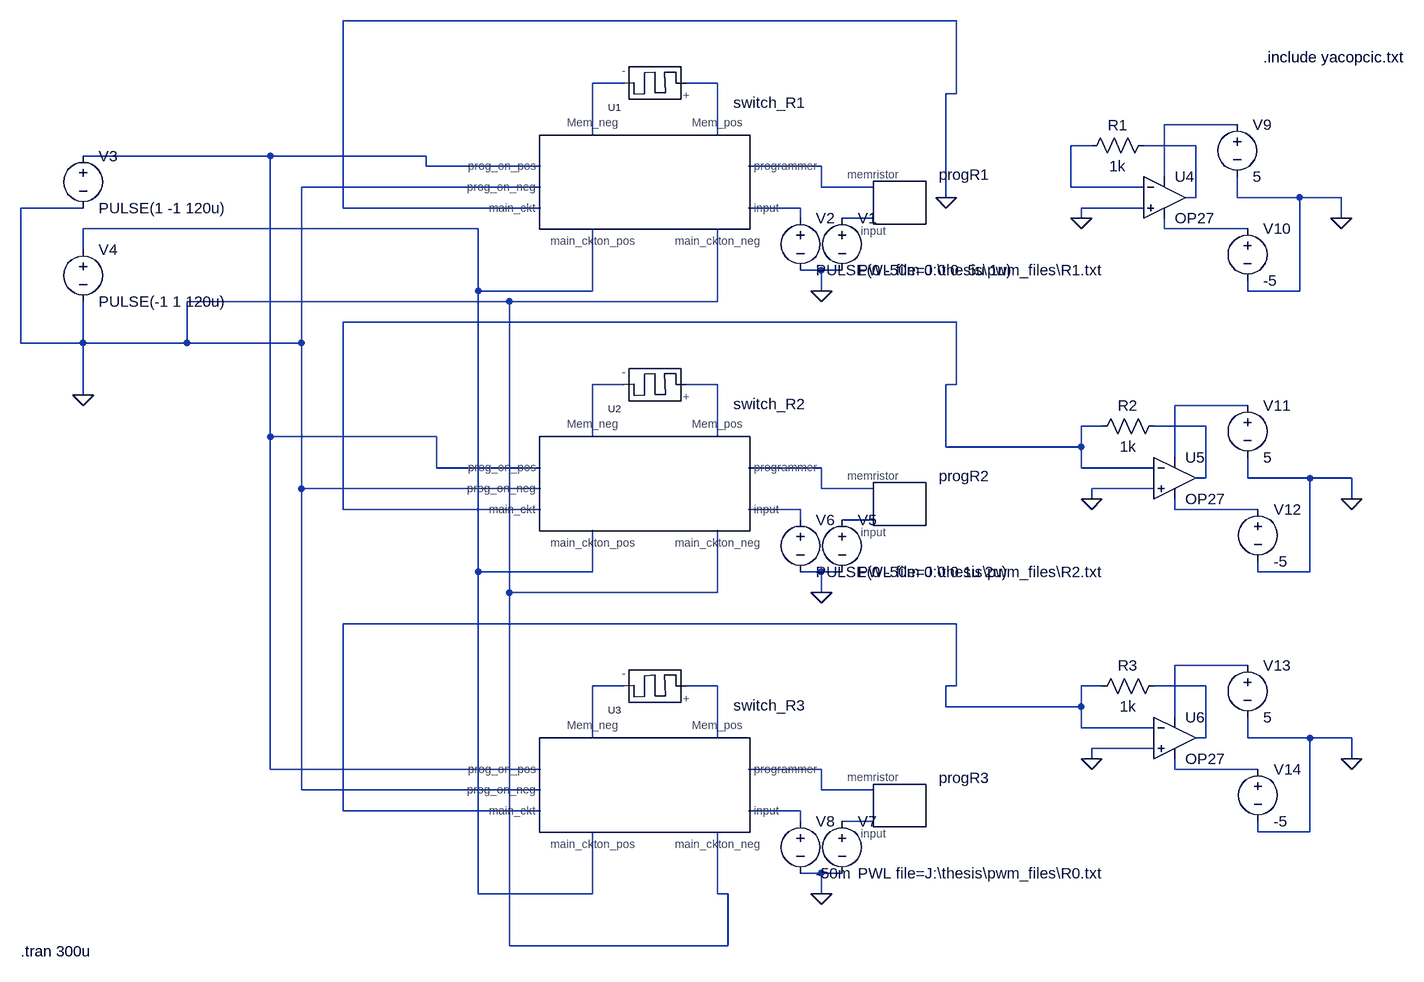
[diagram p0: schematic problem.asc]
problem.asc, the LTspice schematic file:
Version 4
SHEET 1 880 680
WIRE -16 -784 -960 -784
WIRE -528 -688 -576 -688
WIRE -384 -688 -432 -688
WIRE -16 -672 -16 -784
WIRE -16 -672 -32 -672
WIRE 416 -624 304 -624
WIRE -576 -608 -576 -688
WIRE -384 -608 -384 -688
WIRE 192 -592 160 -592
WIRE 352 -592 272 -592
WIRE -1072 -576 -1360 -576
WIRE -832 -576 -1072 -576
WIRE -832 -560 -832 -576
WIRE -656 -560 -832 -560
WIRE -224 -560 -336 -560
WIRE 304 -544 304 -624
WIRE -656 -528 -1024 -528
WIRE -224 -528 -224 -560
WIRE -144 -528 -224 -528
WIRE 160 -528 160 -592
WIRE 272 -528 160 -528
WIRE -32 -512 -32 -672
WIRE 352 -512 352 -592
WIRE 352 -512 336 -512
WIRE 416 -512 416 -544
WIRE 512 -512 416 -512
WIRE 576 -512 512 -512
WIRE -1360 -496 -1456 -496
WIRE -960 -496 -960 -784
WIRE -656 -496 -960 -496
WIRE -256 -496 -336 -496
WIRE 272 -496 176 -496
WIRE -256 -480 -256 -496
WIRE -144 -480 -192 -480
WIRE 176 -480 176 -496
WIRE 576 -480 576 -512
WIRE -752 -464 -1360 -464
WIRE 304 -464 304 -480
WIRE 432 -464 304 -464
WIRE -1360 -432 -1360 -464
WIRE -224 -400 -256 -400
WIRE -192 -400 -224 -400
WIRE -752 -368 -752 -464
WIRE -576 -368 -576 -464
WIRE -576 -368 -752 -368
WIRE -224 -368 -224 -400
WIRE 432 -368 432 -384
WIRE 512 -368 512 -512
WIRE 512 -368 432 -368
WIRE -704 -352 -1200 -352
WIRE -384 -352 -384 -464
WIRE -384 -352 -704 -352
WIRE -16 -320 -960 -320
WIRE -1456 -288 -1456 -496
WIRE -1360 -288 -1360 -352
WIRE -1360 -288 -1456 -288
WIRE -1200 -288 -1200 -352
WIRE -1200 -288 -1360 -288
WIRE -1024 -288 -1024 -528
WIRE -1024 -288 -1200 -288
WIRE -528 -224 -576 -224
WIRE -384 -224 -432 -224
WIRE -16 -224 -16 -320
WIRE -16 -224 -32 -224
WIRE -1360 -208 -1360 -288
WIRE 432 -192 320 -192
WIRE 208 -160 176 -160
WIRE 368 -160 288 -160
WIRE -1072 -144 -1072 -576
WIRE -816 -144 -1072 -144
WIRE -576 -144 -576 -224
WIRE -384 -144 -384 -224
WIRE -32 -128 -32 -224
WIRE 176 -128 176 -160
WIRE 176 -128 -32 -128
WIRE 320 -112 320 -192
WIRE -816 -96 -816 -144
WIRE -656 -96 -816 -96
WIRE -224 -96 -336 -96
WIRE 176 -96 176 -128
WIRE 288 -96 176 -96
WIRE 368 -80 368 -160
WIRE 368 -80 352 -80
WIRE 432 -80 432 -112
WIRE 528 -80 432 -80
WIRE 592 -80 528 -80
WIRE -1024 -64 -1024 -288
WIRE -656 -64 -1024 -64
WIRE -224 -64 -224 -96
WIRE -144 -64 -224 -64
WIRE 288 -64 192 -64
WIRE 192 -48 192 -64
WIRE 592 -48 592 -80
WIRE -960 -32 -960 -320
WIRE -656 -32 -960 -32
WIRE -256 -32 -336 -32
WIRE 320 -32 320 -48
WIRE 448 -32 320 -32
WIRE -256 -16 -256 -32
WIRE -144 -16 -192 -16
WIRE -752 64 -752 -368
WIRE -576 64 -576 0
WIRE -576 64 -752 64
WIRE -224 64 -256 64
WIRE -192 64 -224 64
WIRE 448 64 448 48
WIRE 528 64 528 -80
WIRE 528 64 448 64
WIRE -704 96 -704 -352
WIRE -384 96 -384 0
WIRE -384 96 -704 96
WIRE -224 96 -224 64
WIRE -16 144 -960 144
WIRE 432 208 320 208
WIRE -528 240 -576 240
WIRE -384 240 -432 240
WIRE -16 240 -16 144
WIRE -16 240 -32 240
WIRE 208 240 176 240
WIRE 368 240 288 240
WIRE -32 272 -32 240
WIRE 176 272 176 240
WIRE 176 272 -32 272
WIRE 320 288 320 208
WIRE 176 304 176 272
WIRE 288 304 176 304
WIRE -576 320 -576 240
WIRE -384 320 -384 240
WIRE 368 320 368 240
WIRE 368 320 352 320
WIRE 432 320 432 288
WIRE 528 320 432 320
WIRE 592 320 528 320
WIRE 288 336 192 336
WIRE 192 352 192 336
WIRE 592 352 592 320
WIRE -1072 368 -1072 -144
WIRE -656 368 -1072 368
WIRE -224 368 -336 368
WIRE 320 368 320 352
WIRE 448 368 320 368
WIRE -1024 400 -1024 -64
WIRE -656 400 -1024 400
WIRE -224 400 -224 368
WIRE -144 400 -224 400
WIRE -960 432 -960 144
WIRE -656 432 -960 432
WIRE -256 432 -336 432
WIRE -256 448 -256 432
WIRE -144 448 -192 448
WIRE 448 464 448 448
WIRE 528 464 528 320
WIRE 528 464 448 464
WIRE -224 528 -256 528
WIRE -192 528 -224 528
WIRE -752 560 -752 64
WIRE -576 560 -576 464
WIRE -576 560 -752 560
WIRE -384 560 -384 464
WIRE -368 560 -384 560
WIRE -224 560 -224 528
WIRE -704 640 -704 96
WIRE -368 640 -368 560
WIRE -368 640 -704 640
FLAG -224 -368 0
FLAG -224 96 0
FLAG -224 560 0
FLAG -1360 -208 0
FLAG 176 -480 0
FLAG 576 -480 0
FLAG 192 -48 0
FLAG 592 -48 0
FLAG 192 352 0
FLAG 592 352 0
FLAG -32 -512 0
SYMBOL memristormodel -512 -688 R180
SYMATTR InstName U1
SYMATTR Value MEM_YAKOPCIC
SYMBOL switch_block -576 -560 R0
SYMATTR InstName switch_R1
SYMBOL programmer_block -96 -480 R0
SYMATTR InstName progR1
SYMBOL voltage -192 -496 R0
WINDOW 123 0 0 Left 2
WINDOW 39 0 0 Left 2
SYMATTR InstName V1
SYMATTR Value PWL file=J:\thesis\pwm_files\R1.txt
SYMBOL voltage -256 -496 R0
WINDOW 123 0 0 Left 2
WINDOW 39 0 0 Left 2
SYMATTR InstName V2
SYMATTR Value PULSE(0 -50m 0 0 0 .5u 1u)
SYMBOL voltage -1360 -592 R0
WINDOW 123 0 0 Left 2
WINDOW 39 0 0 Left 2
SYMATTR InstName V3
SYMATTR Value PULSE(1 -1 120u)
SYMBOL voltage -1360 -448 R0
WINDOW 123 0 0 Left 2
WINDOW 39 0 0 Left 2
SYMATTR InstName V4
SYMATTR Value PULSE(-1 1 120u)
SYMBOL memristormodel -512 -224 R180
SYMATTR InstName U2
SYMATTR Value MEM_YAKOPCIC
SYMBOL switch_block -576 -96 R0
SYMATTR InstName switch_R2
SYMBOL programmer_block -96 -16 R0
SYMATTR InstName progR2
SYMBOL voltage -192 -32 R0
WINDOW 123 0 0 Left 2
WINDOW 39 0 0 Left 2
SYMATTR InstName V5
SYMATTR Value PWL file=J:\thesis\pwm_files\R2.txt
SYMBOL voltage -256 -32 R0
WINDOW 123 0 0 Left 2
WINDOW 39 0 0 Left 2
SYMATTR InstName V6
SYMATTR Value PULSE(0 -50m 0 0 0 1u 2u)
SYMBOL memristormodel -512 240 R180
SYMATTR InstName U3
SYMATTR Value MEM_YAKOPCIC
SYMBOL switch_block -576 368 R0
SYMATTR InstName switch_R3
SYMBOL programmer_block -96 448 R0
SYMATTR InstName progR3
SYMBOL voltage -192 432 R0
WINDOW 123 0 0 Left 2
WINDOW 39 0 0 Left 2
SYMATTR InstName V7
SYMATTR Value PWL file=J:\thesis\pwm_files\R0.txt
SYMBOL voltage -256 432 R0
WINDOW 123 0 0 Left 2
WINDOW 39 0 0 Left 2
SYMATTR InstName V8
SYMATTR Value -50m
SYMBOL voltage 416 -640 R0
WINDOW 123 0 0 Left 2
WINDOW 39 0 0 Left 2
SYMATTR InstName V9
SYMATTR Value 5
SYMBOL voltage 432 -480 R0
WINDOW 123 0 0 Left 2
WINDOW 39 0 0 Left 2
SYMATTR InstName V10
SYMATTR Value -5
SYMBOL res 288 -608 R90
WINDOW 0 0 56 VBottom 2
WINDOW 3 32 56 VTop 2
SYMATTR InstName R1
SYMATTR Value 1k
SYMBOL voltage 432 -208 R0
WINDOW 123 0 0 Left 2
WINDOW 39 0 0 Left 2
SYMATTR InstName V11
SYMATTR Value 5
SYMBOL voltage 448 -48 R0
WINDOW 123 0 0 Left 2
WINDOW 39 0 0 Left 2
SYMATTR InstName V12
SYMATTR Value -5
SYMBOL res 304 -176 R90
WINDOW 0 0 56 VBottom 2
WINDOW 3 32 56 VTop 2
SYMATTR InstName R2
SYMATTR Value 1k
SYMBOL voltage 432 192 R0
WINDOW 123 0 0 Left 2
WINDOW 39 0 0 Left 2
SYMATTR InstName V13
SYMATTR Value 5
SYMBOL voltage 448 352 R0
WINDOW 123 0 0 Left 2
WINDOW 39 0 0 Left 2
SYMATTR InstName V14
SYMATTR Value -5
SYMBOL res 304 224 R90
WINDOW 0 0 56 VBottom 2
WINDOW 3 32 56 VTop 2
SYMATTR InstName R3
SYMATTR Value 1k
SYMBOL Opamps\\OP27 304 -576 R0
SYMATTR InstName U4
SYMBOL Opamps\\OP27 320 -144 R0
SYMATTR InstName U5
SYMBOL Opamps\\OP27 320 256 R0
SYMATTR InstName U6
TEXT -1456 648 Left 2 !.tran 300u
TEXT 456 -728 Left 2 !.include yacopcic.txt

The netlist it stands for:
* problem.asc
XU1 N002 N001 M MEM_YAKOPCIC  ; pins + -
Xswitch_R1 N001 N002 N006 0 0 N010 0 N007 N008 switch_block  ; pins Mem_neg Mem_pos prog_on_pos prog_on_neg main_ckt main_ckton_pos main_ckton_neg programmer input
XprogR1 N007 N009 programmer_block  ; pins memristor input
V1 N009 0 PWL file=J:\thesis\pwm_files\R1.txt
V2 N008 0 PULSE(0 -50m 0 0 0 .5u 1u)
V3 N006 0 PULSE(1 -1 120u)
V4 N010 0 PULSE(-1 1 120u)
XU2 N014 N013 M MEM_YAKOPCIC  ; pins + -
Xswitch_R2 N013 N014 N006 0 N012 N010 0 N017 N018 switch_block  ; pins Mem_neg Mem_pos prog_on_pos prog_on_neg main_ckt main_ckton_pos main_ckton_neg programmer input
XprogR2 N017 N020 programmer_block  ; pins memristor input
V5 N020 0 PWL file=J:\thesis\pwm_files\R2.txt
V6 N018 0 PULSE(0 -50m 0 0 0 1u 2u)
XU3 N024 N023 M MEM_YAKOPCIC  ; pins + -
Xswitch_R3 N023 N024 N006 0 N021 N010 0 N026 N028 switch_block  ; pins Mem_neg Mem_pos prog_on_pos prog_on_neg main_ckt main_ckton_pos main_ckton_neg programmer input
XprogR3 N026 N029 programmer_block  ; pins memristor input
V7 N029 0 PWL file=J:\thesis\pwm_files\R0.txt
V8 N028 0 -50m
V9 N003 0 5
V10 N011 0 -5
R1 N005 N004 1k
V11 N015 0 5
V12 N019 0 -5
R2 N016 N012 1k
V13 N022 0 5
V14 N027 0 -5
R3 N025 N021 1k
XU4 0 N004 N003 N011 N005 OP27  ; pins In+ In- V+ V- OUT
XU5 0 N012 N015 N019 N016 OP27  ; pins In+ In- V+ V- OUT
XU6 0 N021 N022 N027 N025 OP27  ; pins In+ In- V+ V- OUT
.tran 300u
.include yacopcic.txt
.lib ADI.lib
.backanno
.end